# EAGLE design Placa do filtro notch (EAGLE 9.6.2)
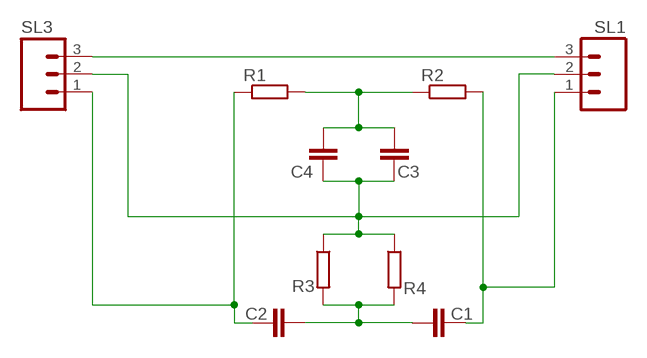
[diagram p0: schematic, sheet 1]

## Parts
C1  C-EUC0805  [C0805]
C2  C-EUC0805  [C0805]
C3  C-EUC0805  [C0805]
C4  C-EUC0805  [C0805]
R1  R-EU_R0805  [R0805]
R2  R-EU_R0805  [R0805]
R3  R-EU_R0805  [R0805]
R4  R-EU_R0805  [R0805]
SL1  M03  [03P]
SL3  M03  [03P]

## Nets
N$1: C1.2 C2.2 R3.2 R4.2
N$6: C2.1 R1.1 SL3.1
N$7: C3.1 C4.1 R3.1 R4.1 SL1.2 SL3.2
N$8: C1.1 R2.2 SL1.1
N$10: C3.2 C4.2 R1.2 R2.1
VCC: SL1.3 SL3.3

## Library data of the parts
C1-C4 = rcl:C-EU: CAPACITOR, European symbol; SPICEPREFIX: C
R1-R4 = rcl:R-EU_: RESISTOR, European symbol; SPICEPREFIX: R
SL1 = con-amp-quick:M03: AMP QUICK CONNECTOR; OC_FARNELL: unknown; OC_NEWARK: unknown; SPICEPREFIX: U
SL3 = con-amp-quick:M03: AMP QUICK CONNECTOR; OC_FARNELL: unknown; OC_NEWARK: unknown; SPICEPREFIX: J

## Board
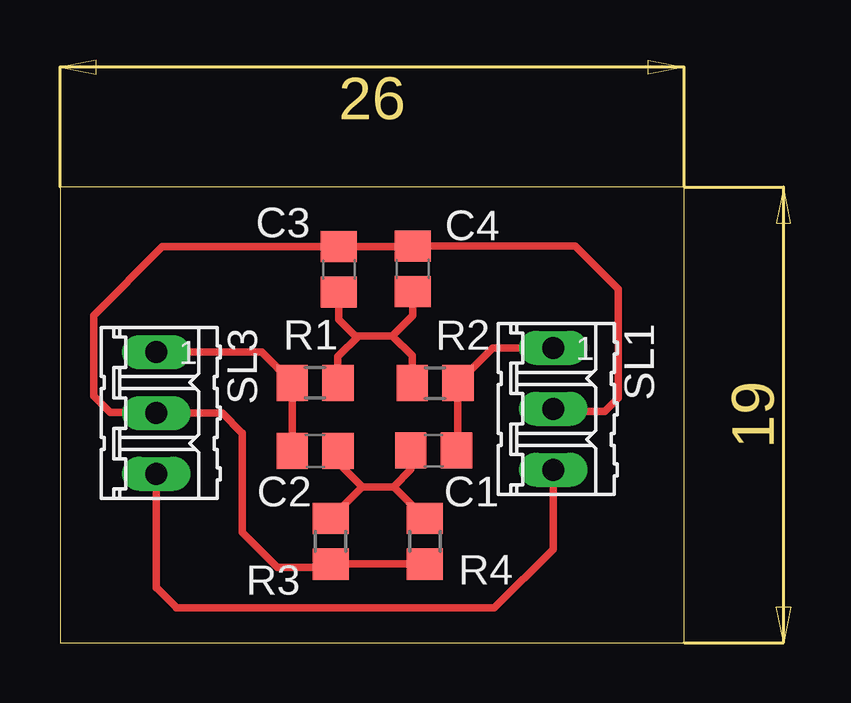
[diagram p1: board, top side]

Size 26 x 19 mm. Coordinates in mm from the lower left corner, seen from the top.
Outline: 0,0 26,0 26,19 0,19 0,0
Copper layers (1*16): Top 0.035mm / dielectric 1.5mm / Bottom 0.035mm
Design rules "default": minimum track width 10mil, minimum drill 24mil, track to track 8mil, track to pad 8mil, pad to pad 8mil, via to via 8mil, smd to smd 8mil, copper to edge 40mil, drill to drill 8mil, minimum pad ring 10mil, minimum via ring 8mil, stop-mask expansion 4mil, vias tented up to drill 0mil, thermal gap 10mil

### Footprints (pad centres in the part's own frame; a part is rotated, then mirrored left to right if it is on the bottom)
C0805 = smd 1.3 x 1.5: 1 -0.95,0; 2 0.95,0
R0805 = smd 1.3 x 1.5: 1 -0.95,0; 2 0.95,0
03P = drill 0.914 long: 1 -2.54,0; 2 0,0; 3 2.54,0

### Placement (x,y rotation side)
C1  15.57,8.01 180 top
C2  10.63,8 0 top
C3  11.62,15.57 270 top
C4  14.7,15.59 270 top
R1  10.63,10.84 0 top
R2  15.63,10.83 0 top
R3  11.28,4.23 90 top
R4  15.2,4.23 90 top
SL1  20.55,9.75 270 top
SL3  4.01,9.58 270 top

### Tracks (layer width: path | path; a pad name or v marks a point on that pad's centre or on a via)
N$1
  Top 0.254: 14.62,7.82 C1.2 | C2.2 11.7,7.88 11.7,7.45 11.75,7.4 11.75,7.55
  Top 0.305: R3.2 12.6,6.5 | 12.6,6.5 13.9,6.5 | 13.9,6.5 15.2,5.2 R4.2 | C1.2 14.62,7.22 13.9,6.5 | C2.2 11.58,7.52 12.6,6.5
N$6
  Top 0.305: SL3.1 8.4,12.12 R1.1 C2.1
N$7
  Top 0.254: SL3.2 3.99,9.6 | 20.65,9.65 SL1.2
  Top 0.305: 3.99,9.6 2.1,9.6 1.4,10.3 1.4,13.65 4.27,16.52 C3.1 14.68,16.52 C4.1 21.46,16.54 23.25,14.75 23.25,10.2 22.7,9.65 20.65,9.65 | SL3.2 6.75,9.58 7.58,8.75 7.6,8.75 7.6,4.6 9.05,3.15 11.15,3.15 R3.1 R4.1
N$8
  Top 0.254: C1.1 16.58,8.07
  Top 0.305: SL1.1 18.04,12.29 R2.2 16.58,8.07
N$10
  Top 0.254: R1.2 11.58,11.43 | 14.65,10.83 R2.1
  Top 0.305: 14.65,11.3 14.65,10.83 | R1.2 11.58,11.93 12.45,12.8 | 12.45,12.8 12.9,12.8 13.85,12.8 | 12.45,12.8 12.3,12.8 11.62,13.48 C3.2 | 13.85,12.8 14.68,11.97 R2.1 | C4.2 14.7,13.65 13.85,12.8
VCC
  Top 0.254: 4.01,2.31 4,2.3 | 4.85,1.47 4.85,1.45 | SL3.3
  Top 0.305: 4.85,1.45 18.1,1.45 20.55,3.9 SL1.3 | 4.01,2.31 4.85,1.47 | 4,2.3 SL3.3